# Altium schematic sheet uart-cut.SchDoc: Power Control MB rev1
size 420 x 297 mm; Date: 20/12/2020; ApprovedBy: Дубас; CheckedBy: Иванов Д.; Author: Разумовский; CompanyName: Р2 Робототехника; Organization: Р2 Робототехника; DocumentNumber: Footprint reference; Revision: 1A; SheetNumber: 4; SheetTotal: 26; TehKontr: Иванов Д.; Normkontr: Дубас; Time: 08/12/2020
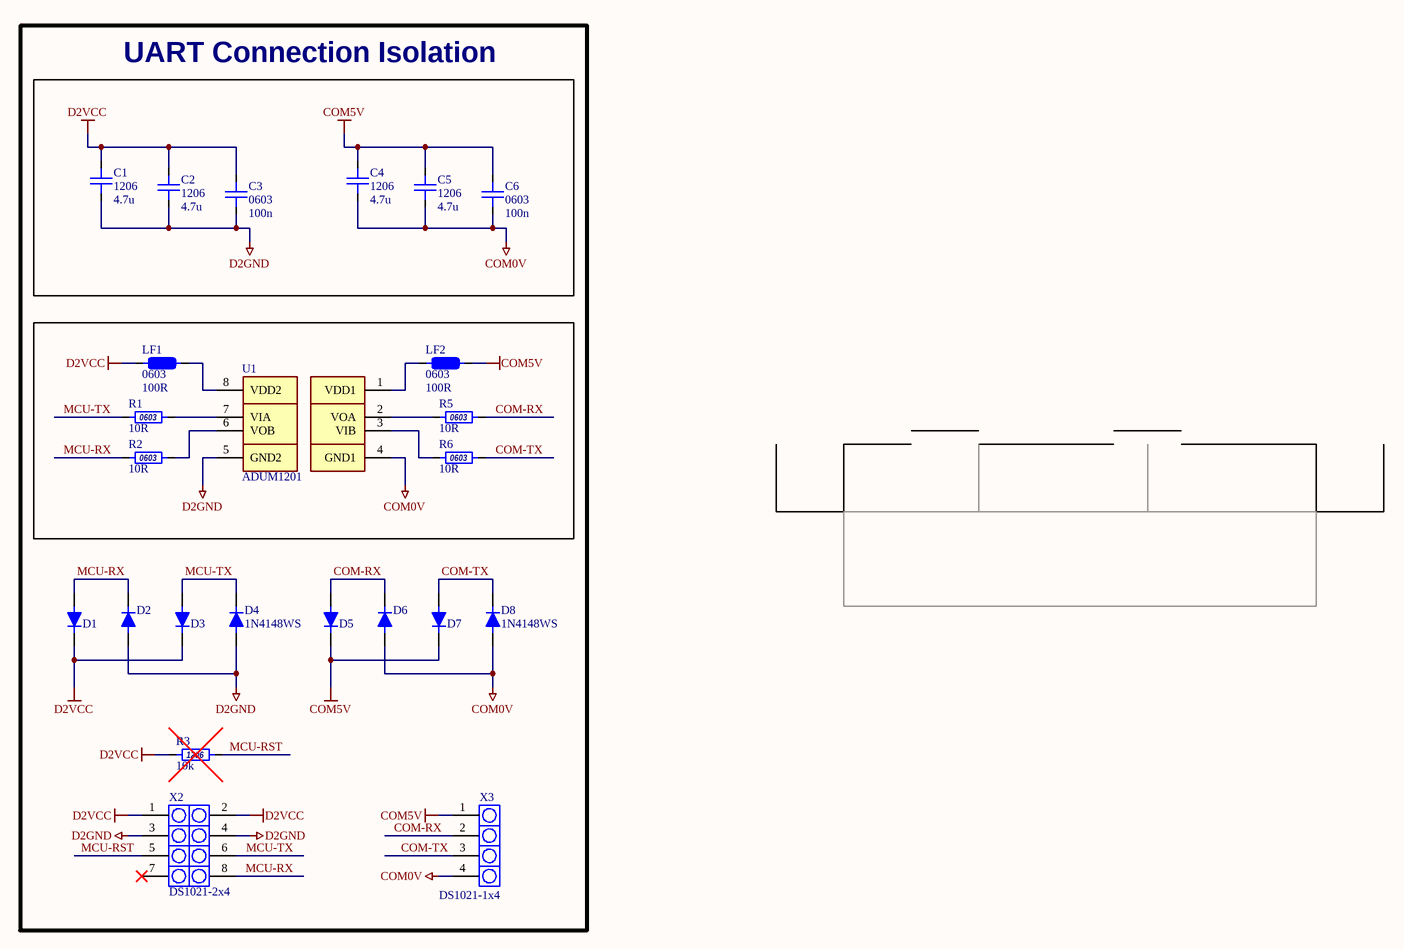
[diagram p0: uart-cut.SchDoc]

## Parts
C1  value 4.7u  Package: 1206  [CAP1206P]  (hidden comment: C12064.7u)
C2  value 4.7u  Package: 1206  [CAP1206P]  (hidden comment: C12064.7u)
C3  value 100n  Package: 0603  [CAP0603P]  (hidden comment: C0603100n)
C4  value 4.7u  Package: 1206  [CAP1206P]  (hidden comment: C12064.7u)
C5  value 4.7u  Package: 1206  [CAP1206P]  (hidden comment: C12064.7u)
C6  value 100n  Package: 0603  [CAP0603P]  (hidden comment: C0603100n)
D1  1N4148WS  [DIOD-SOD323-2-A_V]  (value not drawn)
D2  1N4148WS  [DIOD-SOD323-2-A_V]  (value not drawn)
D3  1N4148WS  [DIOD-SOD323-2-A_V]  (value not drawn)
D4  1N4148WS  [DIOD-SOD323-2-A_V]
D5  1N4148WS  [DIOD-SOD323-2-A_V]  (value not drawn)
D6  1N4148WS  [DIOD-SOD323-2-A_V]  (value not drawn)
D7  1N4148WS  [DIOD-SOD323-2-A_V]  (value not drawn)
D8  1N4148WS  [DIOD-SOD323-2-A_V]
LF1  value 100R  Package: 0603  [IND0603]  (hidden comment: FB0603100R)
LF2  value 100R  Package: 0603  [IND0603]  (hidden comment: FB0603100R)
R1  value 10R  [RES0603]  (hidden comment: R060310R)
R2  value 10R  [RES0603]  (hidden comment: R060310R)
R3  value 10k  [RES1206]  (hidden comment: R120610k)
R5  value 10R  [RES0603]  (hidden comment: R060310R)
R6  value 10R  [RES0603]  (hidden comment: R060310R)
U1  ADUM1201  [SOIC-8]
X2  DS1021-2x4  [PLS-2X4]
X3  DS1021-1x4  [PLS-1X4]

## Blocks framed on the sheet
UART Connection Isolation: C1-C6 D1-D8 LF1 LF2 R1-R3 R5 R6 U1 X2 X3

## Nets
COM0V: C4.1 C5.1 C6.1 D6.1(A) D8.1(A) U1.4(GND1) X3.4
COM5V: C4.2 C5.2 C6.2 D5.2(K) D7.2(K) LF2.1 X3.1
D2GND: C1.1 C2.1 C3.1 D2.1(A) D4.1(A) U1.5(GND2) X2.3 X2.4
D2VCC: C1.2 C2.2 C3.2 D1.2(K) D3.2(K) LF1.1 R3.1 X2.1 X2.2
COM-RX: D5.1(A) D6.2(K) R5.2 X3.2
COM-TX: D7.1(A) D8.2(K) R6.2 X3.3
MCU-RST: R3.2 X2.5
MCU-RX: D1.1(A) D2.2(K) R2.1 X2.8
MCU-TX: D3.1(A) D4.2(K) R1.1 X2.6
NetLF1_2: LF1.2 U1.8(VDD2)
NetLF2_2: LF2.2 U1.1(VDD1)
NetR1_2: R1.2 U1.7(VIA)
NetR2_2: R2.2 U1.6(VOB)
NetR5_1: R5.1 U1.2(VOA)
NetR6_1: R6.1 U1.3(VIB)

Not connected (* = marked no-connect by the designer): X2 7*

## Notes on the sheet
- Перв.примен.
- Справ.№
- Подп. и дата
- Инв.№ дубл.
- Взам.инв.№
- Подп.и дата
- Изм
- Лист
- № докум.
- Подп.
- Дата
- Лит.
- Масса
- Масштаб
- Разраб.
- Пров.
- Т.контр.
- Листов
- Инв.№ подл.
- Н.контр.
- Утв.
- Копировал
- Формат  A3

## Library data of the parts
C1 C2 C4 C5 = C1206: C1206 10% 25V; Manufacturer: Yageo; ManufacturerPartNumber: CC1206KKX7R9BB475; Power/Voltage: 50V; Pads: 2; Tolerance: 10%; Name: C1206; Category: Capacitor
C3 C6 = C0603: C0603 10% 25V; Manufacturer: Yageo; ManufacturerPartNumber: CC0603KRX5R8BB104; Pads: 2; Tolerance: 10%; Name: C0603; Category: Capacitor; Power/Voltage: 25V
D1-D8 = 1N4148WS: Fast Switching Diode, 75 V, 0.3 A, -65 to 150 degC, 2-Pin SOD323, RoHS, Tape and Reel; Manufacturer: Diodes; ManufacturerPartNumber: 1N4148WS-7-F; Pads: 2; Power/Voltage: 0.1A; Value: 100V; Category: Diode; Name: 1N4148WS; Package: SOD-323F; ComponentLink1Description: Datasheet; ComponentLink1URL: https://www.terraelectronica.ru/pdf/show?pdf_file=http%253A%252F%252Fwww.farnell.com%252Fdatasheets%252F1693646.pdf
LF1 LF2 = FB0603: BEAD0603 25% 100R @100MHz 2.0A 45mR; Manufacturer: Murata Electronics; ManufacturerPartNumber: BLM18EG101TN1D; Pads: 2; Tolerance: 25%; Category: Ferrite bead; Power/Voltage: 2.0A; Name: FB0603; ComponentLink1Description: Datasheet; ComponentLink1URL: https://nsk.terraelectronica.ru/pdf/show?pdf_file=http%253A%252F%252Fwww.farnell.com%252Fdatasheets%252F5169.pdf
R1 R2 R5 R6 = R0603: R0603 5%; Manufacturer: Yageo; ManufacturerPartNumber: RC0603JR-0710RL; Power/Voltage: 0.125W; Pads: 2; Tolerance: 5%; Name: R0603; Package: 0603; Category: Resistor
R3 = R1206: R1206 5%; Manufacturer: Yageo; ManufacturerPartNumber: RC1206FR-0710KL; Tolerance: 1%; Power/Voltage: 0.25W; Pads: 2; Package: 1206; Category: Resistor; Name: R1206
U1 = ADUM1201: RX/TX Isolation 5V 1MHz; Manufacturer: Analog Devices; ManufacturerPartNumber: ADUM1201ARZ; Pads: 8; Category: Communication IC; Power/Voltage: 5V; Package: SOIC-8; ComponentLink1Description: Datasheet; ComponentLink1URL: https://datasheet.octopart.com/ADUM1201ARZ-RL7-Analog-Devices-datasheet-11537988.pdf; Name: ADUM1201
X2 = PLS 2x4: Pinout 2x2; Manufacturer: Connfly; Power/Voltage: 50V; Value: 2.54 mm; Pads: 8; ManufacturerPartNumber: DS1021-2x4; Category: Connector TH; Tolerance: *; Package: PLS; Name: DS1021-2
X3 = PLS 1x4: Standard PLS pinout; Manufacturer: Connfly; Power/Voltage: 50V; Value: 2.54 mm; Name: DS1021; Pads: 4; ManufacturerPartNumber: DS1021-1x4; Category: Connector TH; Tolerance: *; Package: PLS